# Altium schematic sheet 44-HARDWARE SCHEMATICS.SchDoc
size 513 x 386 mm
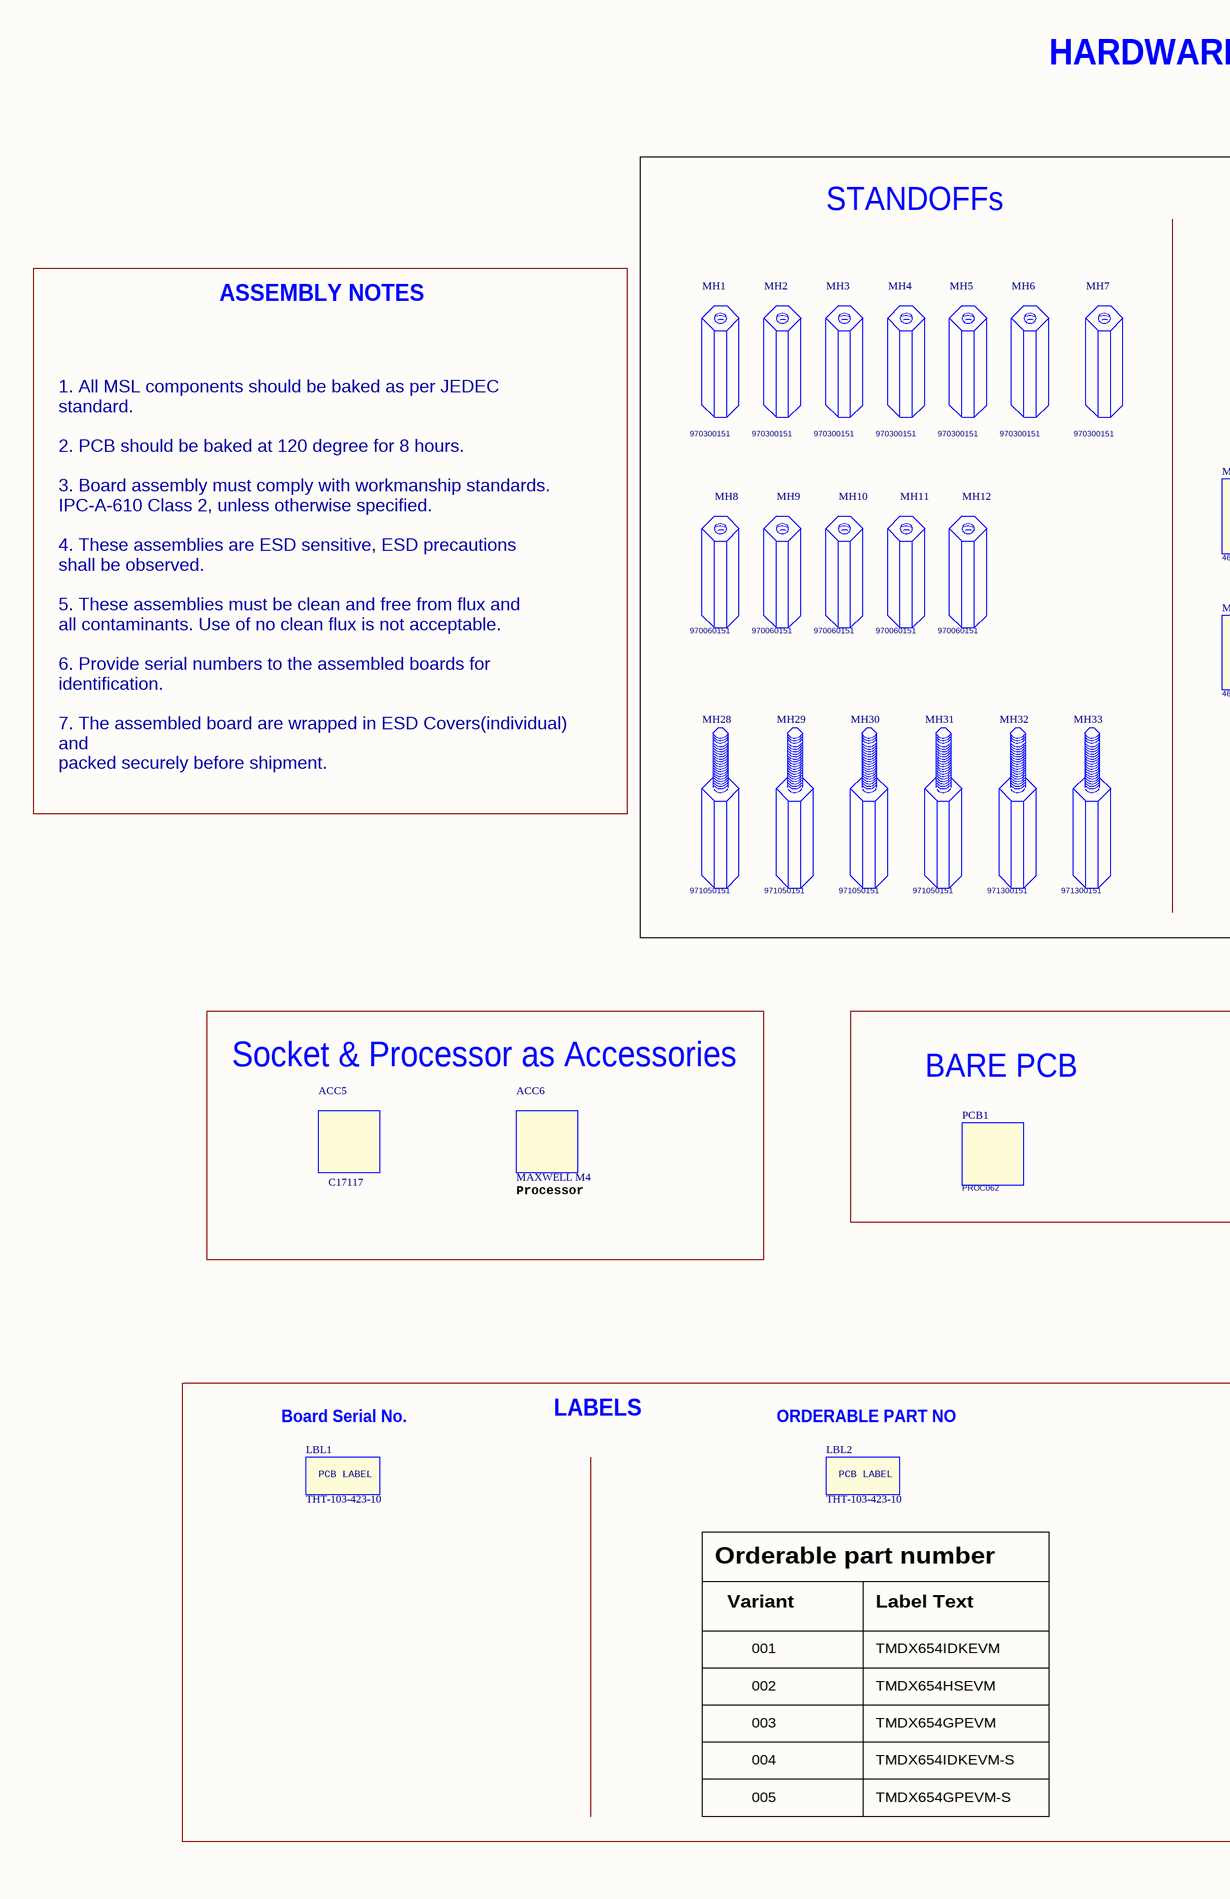
[diagram p0: 44-HARDWARE SCHEMATICS.SchDoc, left]
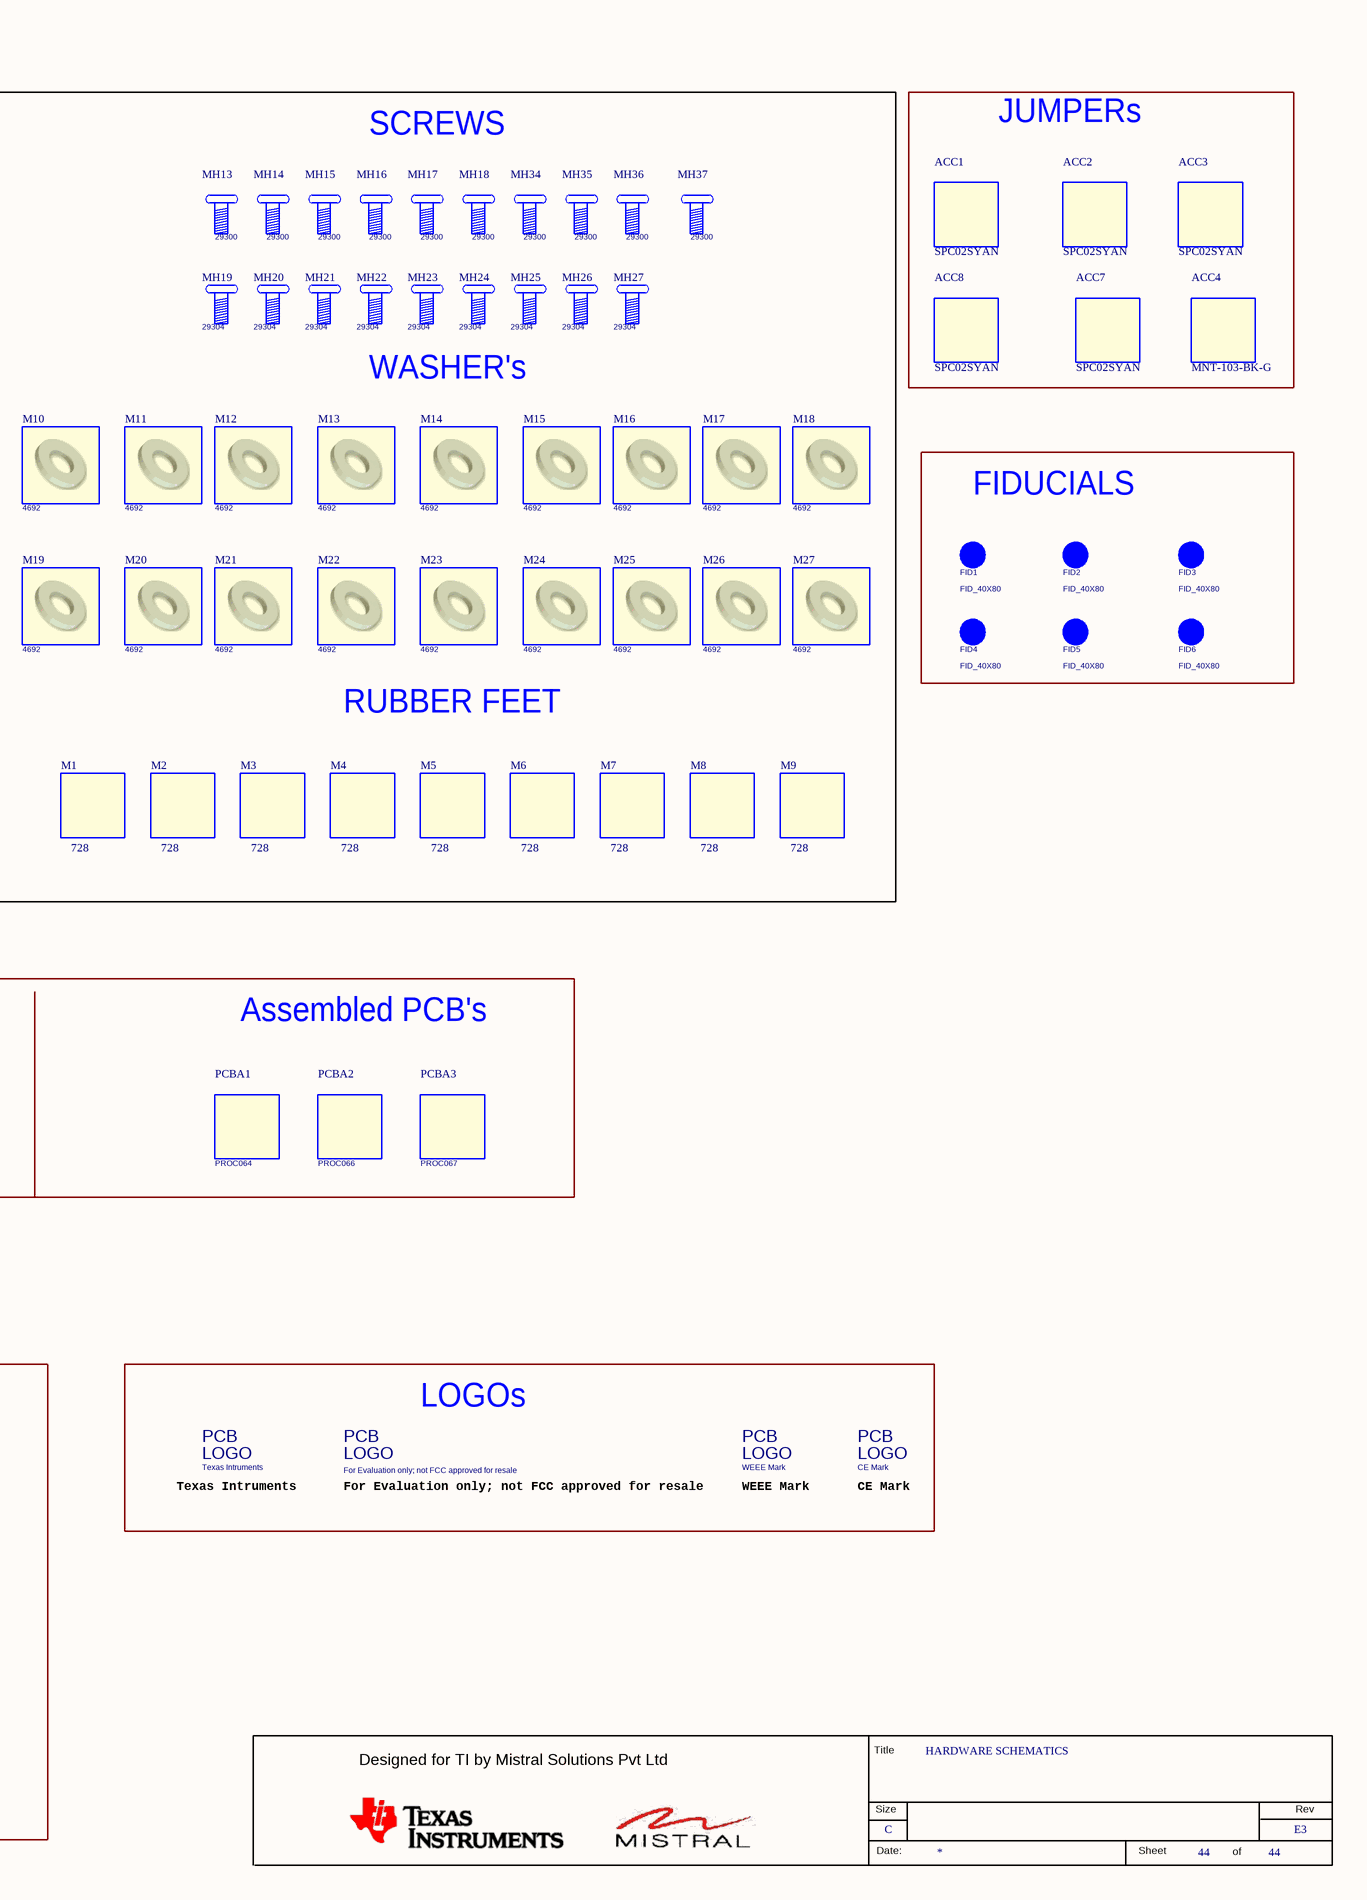
[diagram p1: 44-HARDWARE SCHEMATICS.SchDoc, right]

## Parts
*  RevCode: E3  Title: HARDWARE SCHEMATICS  Page Size: C  Page Number: 44  (hidden comment: MISTRAL_TITLEBLK_CSIZE)  (graphical)
ACC1  SPC02SYAN  [NA]  (mechanical)
ACC2  SPC02SYAN  [NA]  (mechanical)
ACC3  SPC02SYAN  [NA]  (mechanical)
ACC4  MNT-103-BK-G  [NA]  (mechanical)
ACC5  C17117  [BGASKT784_C17117_2170X2170_37-4]
ACC6  MAXWELL M4  [DNI]  (mechanical)
ACC7  SPC02SYAN  [NA]  (mechanical)
ACC8  SPC02SYAN  [NA]  (mechanical)
FID1  FID_40X80  [Fiducial10-20]  (mechanical)
FID2  FID_40X80  [Fiducial10-20]  (mechanical)
FID3  FID_40X80  [Fiducial10-20]  (mechanical)
FID4  FID_40X80  [Fiducial10-20]  (mechanical)
FID5  FID_40X80  [Fiducial10-20]  (mechanical)
FID6  FID_40X80  [Fiducial10-20]  (mechanical)
LBL1  THT-103-423-10  [NA]  (mechanical)
LBL2  THT-103-423-10  [NA]  (mechanical)
Logo1  Texas Intruments  [TI_Stacked_Overlay_Small]  (mechanical)
Logo2  For Evaluation only; not FCC approved for resale  [FCC_disclaimer]  (mechanical)
Logo3  WEEE Mark  [TI_Stacked_Overlay_Small]  (mechanical)
Logo4  CE Mark  [TI_Stacked_Overlay_Small]  (mechanical)
M1  728  [NA]  (mechanical)
M2  728  [NA]  (mechanical)
M3  728  [NA]  (mechanical)
M4  728  [NA]  (mechanical)
M5  728  [NA]  (mechanical)
M6  728  [NA]  (mechanical)
M7  728  [NA]  (mechanical)
M8  728  [NA]  (mechanical)
M9  728  [NA]  (mechanical)
M10  Mfr_part_number: 4692  [NA]  (hidden comment: PLAIN WASHER_M3)  (mechanical)
M11  Mfr_part_number: 4692  [NA]  (hidden comment: PLAIN WASHER_M3)  (mechanical)
M12  Mfr_part_number: 4692  [NA]  (hidden comment: PLAIN WASHER_M3)  (mechanical)
M13  Mfr_part_number: 4692  [NA]  (hidden comment: PLAIN WASHER_M3)  (mechanical)
M14  Mfr_part_number: 4692  [NA]  (hidden comment: PLAIN WASHER_M3)  (mechanical)
M15  Mfr_part_number: 4692  [NA]  (hidden comment: PLAIN WASHER_M3)  (mechanical)
M16  Mfr_part_number: 4692  [NA]  (hidden comment: PLAIN WASHER_M3)  (mechanical)
M17  Mfr_part_number: 4692  [NA]  (hidden comment: PLAIN WASHER_M3)  (mechanical)
M18  Mfr_part_number: 4692  [NA]  (hidden comment: PLAIN WASHER_M3)  (mechanical)
M19  Mfr_part_number: 4692  [NA]  (hidden comment: PLAIN WASHER_M3)  (mechanical)
M20  Mfr_part_number: 4692  [NA]  (hidden comment: PLAIN WASHER_M3)  (mechanical)
M21  Mfr_part_number: 4692  [NA]  (hidden comment: PLAIN WASHER_M3)  (mechanical)
M22  Mfr_part_number: 4692  [NA]  (hidden comment: PLAIN WASHER_M3)  (mechanical)
M23  Mfr_part_number: 4692  [NA]  (hidden comment: PLAIN WASHER_M3)  (mechanical)
M24  Mfr_part_number: 4692  [NA]  (hidden comment: PLAIN WASHER_M3)  (mechanical)
M25  Mfr_part_number: 4692  [NA]  (hidden comment: PLAIN WASHER_M3)  (mechanical)
M26  Mfr_part_number: 4692  [NA]  (hidden comment: PLAIN WASHER_M3)  (mechanical)
M27  Mfr_part_number: 4692  [NA]  (hidden comment: PLAIN WASHER_M3)  (mechanical)
MH1  Mfr_part_number: 970300151  [NA]  (hidden comment: HEX SPACER_M2.5 X 30)  (mechanical)
MH2  Mfr_part_number: 970300151  [NA]  (hidden comment: HEX SPACER_M2.5 X 30)  (mechanical)
MH3  Mfr_part_number: 970300151  [NA]  (hidden comment: HEX SPACER_M2.5 X 30)  (mechanical)
MH4  Mfr_part_number: 970300151  [NA]  (hidden comment: HEX SPACER_M2.5 X 30)  (mechanical)
MH5  Mfr_part_number: 970300151  [NA]  (hidden comment: HEX SPACER_M2.5 X 30)  (mechanical)
MH6  Mfr_part_number: 970300151  [NA]  (hidden comment: HEX SPACER_M2.5 X 30)  (mechanical)
MH7  Mfr_part_number: 970300151  [NA]  (hidden comment: HEX SPACER_M2.5 X 30)  (mechanical)
MH8  Mfr_part_number: 970060151  [NA]  (hidden comment: HEX SPACER_M2.5 X 6)  (mechanical)
MH9  Mfr_part_number: 970060151  [NA]  (hidden comment: HEX SPACER_M2.5 X 6)  (mechanical)
MH10  Mfr_part_number: 970060151  [NA]  (hidden comment: HEX SPACER_M2.5 X 6)  (mechanical)
MH11  Mfr_part_number: 970060151  [NA]  (hidden comment: HEX SPACER_M2.5 X 6)  (mechanical)
MH12  Mfr_part_number: 970060151  [NA]  (hidden comment: HEX SPACER_M2.5 X 6)  (mechanical)
MH13  Mfr_part_number: 29300  [NA]  (hidden comment: PAN HEAD_M2.5 X 4)  (mechanical)
MH14  Mfr_part_number: 29300  [NA]  (hidden comment: PAN HEAD_M2.5 X 4)  (mechanical)
MH15  Mfr_part_number: 29300  [NA]  (hidden comment: PAN HEAD_M2.5 X 4)  (mechanical)
MH16  Mfr_part_number: 29300  [NA]  (hidden comment: PAN HEAD_M2.5 X 4)  (mechanical)
MH17  Mfr_part_number: 29300  [NA]  (hidden comment: PAN HEAD_M2.5 X 4)  (mechanical)
MH18  Mfr_part_number: 29300  [NA]  (hidden comment: PAN HEAD_M2.5 X 4)  (mechanical)
MH19  Mfr_part_number: 29304  [NA]  (hidden comment: PAN HEAD_M2.5 X 12)  (mechanical)
MH20  Mfr_part_number: 29304  [NA]  (hidden comment: PAN HEAD_M2.5 X 12)  (mechanical)
MH21  Mfr_part_number: 29304  [NA]  (hidden comment: PAN HEAD_M2.5 X 12)  (mechanical)
MH22  Mfr_part_number: 29304  [NA]  (hidden comment: PAN HEAD_M2.5 X 12)  (mechanical)
MH23  Mfr_part_number: 29304  [NA]  (hidden comment: PAN HEAD_M2.5 X 12)  (mechanical)
MH24  Mfr_part_number: 29304  [NA]  (hidden comment: PAN HEAD_M2.5 X 12)  (mechanical)
MH25  Mfr_part_number: 29304  [NA]  (hidden comment: PAN HEAD_M2.5 X 12)  (mechanical)
MH26  Mfr_part_number: 29304  [NA]  (hidden comment: PAN HEAD_M2.5 X 12)  (mechanical)
MH27  Mfr_part_number: 29304  [NA]  (hidden comment: PAN HEAD_M2.5 X 12)  (mechanical)
MH28  Mfr_part_number: 971050151  [NA]  (hidden comment: HEX SPACER_M2.5 X 5)  (mechanical)
MH29  Mfr_part_number: 971050151  [NA]  (hidden comment: HEX SPACER_M2.5 X 5)  (mechanical)
MH30  Mfr_part_number: 971050151  [NA]  (hidden comment: HEX SPACER_M2.5 X 5)  (mechanical)
MH31  Mfr_part_number: 971050151  [NA]  (hidden comment: HEX SPACER_M2.5 X 5)  (mechanical)
MH32  Mfr_part_number: 971300151  [NA]  (hidden comment: HEX SPACER_M2.5 X 30)  (mechanical)
MH33  Mfr_part_number: 971300151  [NA]  (hidden comment: HEX SPACER_M2.5 X 30)  (mechanical)
MH34  Mfr_part_number: 29300  [NA]  (hidden comment: PAN HEAD_M2.5 X 4)  (mechanical)
MH35  Mfr_part_number: 29300  [NA]  (hidden comment: PAN HEAD_M2.5 X 4)  (mechanical)
MH36  Mfr_part_number: 29300  [NA]  (hidden comment: PAN HEAD_M2.5 X 4)  (mechanical)
MH37  Mfr_part_number: 29300  [NA]  (hidden comment: PAN HEAD_M2.5 X 4)  (mechanical)
PCB1  Mfr_part_number: PROC062  [NA]  (hidden comment: AM65x EVM BARE PCB)  (mechanical)
PCBA1  Mfr_part_number: PROC064  [NA]  (hidden comment: AM6x IDK APPLICATION CARD)  (mechanical)
PCBA2  Mfr_part_number: PROC066  [NA]  (hidden comment: AM6x USB3/PCIE SERDES CARD)  (mechanical)
PCBA3  Mfr_part_number: PROC067  [NA]  (hidden comment: AM6x PCIE-2 LANE SERDES CARD)  (mechanical)

## Blocks framed on the sheet
JUMPERs: ACC1-ACC4 ACC7 ACC8
FIDUCIALS: FID1-FID6
Socket & Processor as Accessories: ACC5 ACC6
LABELS: LBL1 LBL2
LOGOs: Logo1-Logo4

## Notes on the sheet
- HARDWARE SCHEMATICS
- STANDOFFs
- SCREWS
- ASSEMBLY NOTES
- WASHER's
- RUBBER FEET
- 1. All MSL components should be baked as per JEDEC
  standard.
  2. PCB should be baked at 120 degree for 8 hours.
  3. Board assembly must comply with workmanship standards.
  IPC-A-610 Class 2, unless otherwise specified.
  4. These assemblies are ESD sensitive, ESD precautions
  shall be observed.
  5. These assemblies must be clean and free from flux and
  all contaminants. Use of no clean flux is not acceptable.
  6. Provide serial numbers to the assembled boards for
  identification.
  7. The assembled board are wrapped in ESD Covers(individual)
  and
  packed securely before shipment.
- (near PCB1) BARE PCB
- Assembled PCB's
- Processor
- (near LBL1) Board Serial No.
- (near LBL2) ORDERABLE PART NO
- Texas Intruments
- For Evaluation only; not FCC approved for resale
- WEEE Mark
- CE Mark
- Orderable part number
- Variant
- 001
- Label Text
- TMDX654IDKEVM
- 002
- TMDX654HSEVM
- 003
- 004
- TMDX654GPEVM
- TMDX654IDKEVM-S
- 005
- TMDX654GPEVM-S
- (in symbol ACCESSORY_THT-3-423-10) PCB LABEL
- (in symbol FCC_disclaimer) PCB; LOGO
- (in symbol MISTRAL_TITLEBLK_CSIZE) Title; Designed for TI by Mistral Solutions Pvt Ltd; Size; Rev; Date:; Sheet; of
- (in symbol TI_Logo) PCB; LOGO
- (in symbol TI_Logo_Dup1) PCB; LOGO

## Library data of the parts
* = MISTRAL_TITLEBLK_CSIZE: Issue: 1.0; Page Create Date: March  8, 1995; Page Count: 44; Page Modify Date: *
ACC1 ACC3 ACC7 = ACCESSORY: ACCESSORIE JUMPER SHORTING GOLD FLASH; Mistral Part No: 160009030153-R; Mfr_name: SULLINS CONNECTOR; Part_type: ACCESSORIES; Project: SMART VIEW_NVR; PCB Footprint: NA; Footprint Path: Y:\MIS_DATABASE\Library\ALTIUM_TOOL\PCB_FOOTPRINTS\Altium_Footprint_Lib.PcbLib; Library Path: Y:\MIS_DATABASE\Library\ALTIUM_TOOL\SCHEMATICS_PARTS\MS_MECHANICAL_Library.schlib; MECHANICAL 3D STEP FILE: NA; Temperature: -55°C+105°C; Weight: NA; Wattage: NA; Voltage: NA; Tolerance: NA; Mfr_part_number: SPC02SYAN; Package: NA; Distributor_name: DIGIKEY; Distributor_part_number: S9001-ND; Library Ref: ACCESSORY; Height: NA; Datasheet: Y:\MIS_DATABASE\DATASHEETS\MISC\MODULES\SPC02SYAN.PDF; Crtd /date: USMAN/301208; Chkd/date: SUHAS\211010
ACC2 ACC8 = ACCESSORY: ACCESSORIE JUMPER SHORTING GOLD FLASH; Part_type: ACCESSORIES; Mfr_name: SULLINS CONNECTOR; Mistral Part No: 160009030153-R; Project: SMART VIEW_NVR; PCB Footprint: NA; Footprint Path: Y:\MIS_DATABASE\Library\ALTIUM_TOOL\PCB_FOOTPRINTS\Altium_Footprint_Lib.PcbLib; Library Path: Y:\MIS_DATABASE\Library\ALTIUM_TOOL\SCHEMATICS_PARTS\MS_MECHANICAL_Library.schlib; MECHANICAL 3D STEP FILE: NA; Temperature: -55°C+105°C; Weight: NA; Wattage: NA; Voltage: NA; Tolerance: NA; Chkd/date: SUHAS\211010; Crtd /date: USMAN/301208; Datasheet: Y:\MIS_DATABASE\DATASHEETS\MISC\MODULES\SPC02SYAN.PDF; Height: NA; Library Ref: ACCESSORY; Distributor_part_number: S9001-ND; Distributor_name: DIGIKEY; Package: NA; Mfr_part_number: SPC02SYAN
ACC4 = ACCESSORY: ACCESSORIE CONNECTOR SHUNT 2X3 POS EDGE MOUNT SOCKET STRIP; Part_type: ACCESSORIES; Mfr_name: SAMTEC; Mistral Part No: 160017110050-R; Project: TI_MAXIE_CPB; PCB Footprint: NA; MECHANICAL 3D STEP FILE: NA; Chkd/date: MANIRAJA/141117; Crtd /date: MANIRAJA/141117; Datasheet: Y:\MIS_DATABASE\DATASHEETS\MISC\ACCESSORIES\SAMTEC-MNT-SER.PDF; Temperature: -55°C+125°C; Weight: NA; Height: NA; Distributor_part_number: SAM10620-ND; Distributor_name: DIGIKEY; Package: NA; Wattage: NA; Voltage: NA; Tolerance: NA; Mfr_part_number: MNT-103-BK-G; Library Ref: ACCESSORY
ACC5 = ACCESSORY: ACCESSORIE BGA SOCKET MAXWELL M4 MICROPROCESSOR BGA784; Part_type: ACCESSORIES; Mfr_name: IRONWOOD ELECTRONICS; Mistral Part No: 160017090045; Wattage: NA; Project: TI_SVB_MAXWELL_DUT; MECHANICAL 3D STEP FILE: BGASKT784_C17117_2170X2170_37-4; Chkd/date: MANIRAJA/190917; Crtd /date: MANIRAJA/190917; Datasheet: Y:\MIS_DATABASE\DATASHEETS\MISC\ACCESSORIES\C17117.PDF; Temperature: NA; Weight: 105.46g; Height: 37.34MM; Library Ref: ACCESSORY; Distributor_part_number: NA; Distributor_name: NA; Package: BGA784; Voltage: NA; Tolerance: NA; Mfr_part_number: C17117; PCB Footprint: BGASKT784_C17117_2170X2170_37-4
ACC6 = ACCESSORY: IC MAXWELL MICRO CONTROLLER UNIT BGA784; Part_type: ICS\DIGITAL\MICROCONTROLLER; Mfr_name: TEXAS INSTRUMENTS; Mistral Part No: 141217070003; MECHANICAL 3D STEP FILE: BGA784_31-49_910X910_1-7; Wattage: NA; Project: TI_SVB_MAXWELL_DUT; Customs_HS_Code: 85423100; Custom_Duty: 15%; Chkd/date: MANIRAJA/130717; Crtd /date: MANIRAJA/130717; Datasheet: Y:\MIS_DATABASE\DATASHEETS\ICS\DIGITAL\MICROCONTROLLER\MAXWELLM4.PDF; Temperature: NA; Weight: NA; Height: 1.63MM; Distributor_part_number: NA; Distributor_name: NA; Package: BGA784; Voltage: NA; Tolerance: NA; Mfr_part_number: MAXWELL M4; Library Ref: MAXWELLM4; PCB Footprint: BGA784_31-49_910X910_1-7
FID1-FID6 = Fiducial: NI_MARK: DNI; PCB Footprint: FID_40X80
LBL1 LBL2 = ACCESSORY_THT-3-423-10: ACCESSORIE 1 WORKHORSE POLYSTER LABLE 0.25" X 1"; Mistral Part No: 160018020185; Mfr_name: BRADY; Part_type: ACCESSORIES; Project: TI_MAXIE_CPB; Mfr_part_number: THT-103-423-10; Tolerance: NA; Voltage: NA; Wattage: NA; Package: NA; Distributor_name: NA; Distributor_part_number: NA; Library Ref: ACCESSORY_THT-3-423-10; Footprint Ref: NA; Height: NA; Weight: NA; Temperature: NA; Datasheet: NA; Crtd /date: ALVY/260218; Chkd/date: MANIRAJA/270218; MECHANICAL 3D STEP FILE: NA; Library Path: Y:\MIS_DATABASE\Library\ALTIUM_TOOL\SCHEMATICS_PARTS\MS_MECHANICAL_Library.schlib; Footprint Path: Y:\MIS_DATABASE\Library\ALTIUM_TOOL\PCB_FOOTPRINTS\Altium_Footprint_Lib.PcbLib; PCB Footprint: NA
Logo1 Logo3 = TI_Logo_Dup1: NI_MARK: DNI
Logo2 = FCC_disclaimer: NI_MARK: DNI; PCB Footprint: FCC_disclaimer
Logo4 = TI_Logo: NI_MARK: DNI; PCB Footprint: TI_Stacked_Overlay_Small
M1 M4 M7 = ACCESSORY: ACCESSORIE RECESSED BUMPER 19.05MM DIA; Part_type: ACCESSORIES; Mfr_name: KEYSTONE; Mistral Part No: 160018070042-R; Project: TI_MAXIE_CPB; Footprint Path: NA; Library Path: NA; MECHANICAL 3D STEP FILE: NA; Custom_Duty: NA; Customs_HS_Code: NA; Chkd/date: MANIRAJA/110718; Crtd /date: MANIRAJA/110718; Datasheet: Y:\MIS_DATABASE\DATASHEETS\MISC\ACCESSORIES\728.PDF; Temperature: NA; Weight: 2042mg; Height: NA; Library Ref: ACCESSORY; Distributor_part_number: 36-728-ND; Distributor_name: DIGIKEY; Package: NA; Wattage: NA; Voltage: NA; Tolerance: NA; Mfr_part_number: 728; Footprint Ref: NA; PCB Footprint: NA
M2 M3 M5 M6 M8 M9 = ACCESSORY: ACCESSORIE RECESSED BUMPER 19.05MM DIA; Mistral Part No: 160018070042-R; Mfr_name: KEYSTONE; Part_type: ACCESSORIES; Project: TI_MAXIE_CPB; Footprint Ref: NA; Mfr_part_number: 728; Tolerance: NA; Voltage: NA; Wattage: NA; Package: NA; Distributor_name: DIGIKEY; Distributor_part_number: 36-728-ND; Library Ref: ACCESSORY; Height: NA; Weight: 2042mg; Temperature: NA; Datasheet: Y:\MIS_DATABASE\DATASHEETS\MISC\ACCESSORIES\728.PDF; Crtd /date: MANIRAJA/110718; Chkd/date: MANIRAJA/110718; Customs_HS_Code: NA; Custom_Duty: NA; MECHANICAL 3D STEP FILE: NA; Library Path: NA; Footprint Path: NA; PCB Footprint: NA
M10-M12 M14 M16 M18-M24 M26 M27 = WASHER_PLAIN: PLAIN WASHER FOR M3 SS-316; Part_type: MECHANICAL\WASHERS; Mfr_name: KEYSTONE; Mistral Part No: 160018020078-R; Project: TI_MAXIE_CPB; Footprint Path: Y:\MIS_DATABASE\Library\ALTIUM_TOOL\PCB_FOOTPRINTS\Altium_Footprint_Lib.PcbLib; Library Path: Y:\MIS_DATABASE\Library\ALTIUM_TOOL\SCHEMATICS_PARTS\MS_MECHANICAL_Library.schlib; MECHANICAL 3D STEP FILE: NA; Chkd/date: MANIRAJA/190218; Crtd /date: MANIRAJA/190218; Datasheet: Y:\MIS_DATABASE\DATASHEETS\MISC\MECHANICAL\4692.PDF; Temperature: NA; Weight: NA; Height: NA; Footprint Ref: NA; Library Ref: WASHER_PLAIN; Distributor_part_number: 36-4692-ND; Distributor_name: DIGIKEY; Package: SS; Wattage: NA; Voltage: NA; Tolerance: NA; PCB Footprint: NA
M13 M15 M17 M25 = WASHER_PLAIN: PLAIN WASHER FOR M3 SS-316; Mistral Part No: 160018020078-R; Mfr_name: KEYSTONE; Part_type: MECHANICAL\WASHERS; Project: TI_MAXIE_CPB; Tolerance: NA; Voltage: NA; Wattage: NA; Package: SS; Distributor_name: DIGIKEY; Distributor_part_number: 36-4692-ND; Library Ref: WASHER_PLAIN; Footprint Ref: NA; Height: NA; Weight: NA; Temperature: NA; Datasheet: Y:\MIS_DATABASE\DATASHEETS\MISC\MECHANICAL\4692.PDF; Crtd /date: MANIRAJA/190218; Chkd/date: MANIRAJA/190218; MECHANICAL 3D STEP FILE: NA; Library Path: Y:\MIS_DATABASE\Library\ALTIUM_TOOL\SCHEMATICS_PARTS\MS_MECHANICAL_Library.schlib; Footprint Path: Y:\MIS_DATABASE\Library\ALTIUM_TOOL\PCB_FOOTPRINTS\Altium_Footprint_Lib.PcbLib; PCB Footprint: NA
MH1 = HEX_SPACER_FF: HEX SPACER FEMALE TO FEMALE M2.5 X 30MM; Part_type: MECHANICAL\SPACER; Mfr_name: WURTH ELECTRONICS; Mistral Part No: 160018020071-R; Project: TI_MAXIE_CPB; Footprint Path: Y:\MIS_DATABASE\Library\ALTIUM_TOOL\PCB_FOOTPRINTS\Altium_Footprint_Lib.PcbLib; Library Path: Y:\MIS_DATABASE\Library\ALTIUM_TOOL\SCHEMATICS_PARTS\MS_MECHANICAL_Library.schlib; MECHANICAL 3D STEP FILE: NA; Chkd/date: MANIRAJA/190218; Crtd /date: MANIRAJA/190218; Datasheet: Y:\MIS_DATABASE\DATASHEETS\MISC\MECHANICAL\970XXX1.PDF; Temperature: NA; Weight: NA; Height: 30.00MM; Footprint Ref: NA; Library Ref: HEX_SPACER_FF; Distributor_part_number: 732-10626-ND; Distributor_name: DIGIKEY; Package: SS; Wattage: NA; Voltage: NA; Tolerance: NA; PCB Footprint: NA
MH2-MH7 = HEX_SPACER_FF: HEX SPACER FEMALE TO FEMALE M2.5 X 30MM; Mistral Part No: 160018020071-R; Mfr_name: WURTH ELECTRONICS; Part_type: MECHANICAL\SPACER; Project: TI_MAXIE_CPB; Tolerance: NA; Voltage: NA; Wattage: NA; Package: SS; Distributor_name: DIGIKEY; Distributor_part_number: 732-10626-ND; Library Ref: HEX_SPACER_FF; Footprint Ref: NA; Height: 30.00MM; Weight: NA; Temperature: NA; Datasheet: Y:\MIS_DATABASE\DATASHEETS\MISC\MECHANICAL\970XXX1.PDF; Crtd /date: MANIRAJA/190218; Chkd/date: MANIRAJA/190218; MECHANICAL 3D STEP FILE: NA; Library Path: Y:\MIS_DATABASE\Library\ALTIUM_TOOL\SCHEMATICS_PARTS\MS_MECHANICAL_Library.schlib; Footprint Path: Y:\MIS_DATABASE\Library\ALTIUM_TOOL\PCB_FOOTPRINTS\Altium_Footprint_Lib.PcbLib; PCB Footprint: NA
MH8-MH12 = HEX_SPACER_FF: HEX SPACER FEMALE TO FEMALE M2.5 X 6MM; Mistral Part No: 160018020075-R; Mfr_name: WURTH ELECTRONICS; Part_type: MECHANICAL\SPACER; Project: TI_MAXIE_CPB; Tolerance: NA; Voltage: NA; Wattage: NA; Package: SS; Distributor_name: DIGIKEY; Distributor_part_number: 732-10524-ND; Library Ref: HEX_SPACER_FF; Footprint Ref: NA; Height: 6.00MM; Weight: NA; Temperature: NA; Datasheet: Y:\MIS_DATABASE\DATASHEETS\MISC\MECHANICAL\970XXX1.PDF; Crtd /date: MANIRAJA/190218; Chkd/date: MANIRAJA/190218; MECHANICAL 3D STEP FILE: NA; Library Path: Y:\MIS_DATABASE\Library\ALTIUM_TOOL\SCHEMATICS_PARTS\MS_MECHANICAL_Library.schlib; Footprint Path: Y:\MIS_DATABASE\Library\ALTIUM_TOOL\PCB_FOOTPRINTS\Altium_Footprint_Lib.PcbLib; PCB Footprint: NA
MH13 MH14 MH18 MH35 = SCREW_PAN: PHILLIPS PAN HEAD SCREW - M2.5 X 4 SS-316; Part_type: MECHANICAL\SCREWS; Mfr_name: KEYSTONE; Mistral Part No: 160018020076-R; Project: TI_MAXIE_CPB; Footprint Path: Y:\MIS_DATABASE\Library\ALTIUM_TOOL\PCB_FOOTPRINTS\Altium_Footprint_Lib.PcbLib; Library Path: Y:\MIS_DATABASE\Library\ALTIUM_TOOL\SCHEMATICS_PARTS\MS_MECHANICAL_Library.schlib; MECHANICAL 3D STEP FILE: NA; Chkd/date: MANIRAJA/190218; Crtd /date: MANIRAJA/190218; Datasheet: Y:\MIS_DATABASE\DATASHEETS\MISC\MECHANICAL\29300.PDF; Temperature: NA; Weight: NA; Height: 4.00MM; Footprint Ref: NA; Library Ref: SCREW_PAN; Distributor_part_number: 36-29300-ND; Distributor_name: DIGIKEY; Package: SS; Wattage: NA; Voltage: NA; Tolerance: NA; PCB Footprint: NA
MH15-MH17 MH34 MH36 MH37 = SCREW_PAN: PHILLIPS PAN HEAD SCREW - M2.5 X 4 SS-316; Mistral Part No: 160018020076-R; Mfr_name: KEYSTONE; Part_type: MECHANICAL\SCREWS; Project: TI_MAXIE_CPB; Tolerance: NA; Voltage: NA; Wattage: NA; Package: SS; Distributor_name: DIGIKEY; Distributor_part_number: 36-29300-ND; Library Ref: SCREW_PAN; Footprint Ref: NA; Height: 4.00MM; Weight: NA; Temperature: NA; Datasheet: Y:\MIS_DATABASE\DATASHEETS\MISC\MECHANICAL\29300.PDF; Crtd /date: MANIRAJA/190218; Chkd/date: MANIRAJA/190218; MECHANICAL 3D STEP FILE: NA; Library Path: Y:\MIS_DATABASE\Library\ALTIUM_TOOL\SCHEMATICS_PARTS\MS_MECHANICAL_Library.schlib; Footprint Path: Y:\MIS_DATABASE\Library\ALTIUM_TOOL\PCB_FOOTPRINTS\Altium_Footprint_Lib.PcbLib; PCB Footprint: NA
MH19 MH21 MH23 MH25 = SCREW_PAN: PHILLIPS PAN HEAD SCREW - M2.5 X 12; Part_type: ACCESSORIES; Mfr_name: KEYSTONE; Mistral Part No: 160018070043-R; Project: TI_MAXIE_CPB; Footprint Path: NA; Library Path: NA; MECHANICAL 3D STEP FILE: NA; Custom_Duty: NA; Customs_HS_Code: NA; Chkd/date: MANIRAJA/110718; Crtd /date: MANIRAJA/110718; Datasheet: Y:\MIS_DATABASE\DATASHEETS\MISC\MECHANICAL\29304.PDF; Temperature: NA; Weight: NA; Height: 12.00MM; Library Ref: SCREW_PAN; Distributor_part_number: 36-29304-ND; Distributor_name: DIGIKEY; Package: NA; Wattage: NA; Voltage: NA; Tolerance: NA; Footprint Ref: NA; PCB Footprint: NA
MH20 MH22 MH24 MH26 MH27 = SCREW_PAN: PHILLIPS PAN HEAD SCREW - M2.5 X 12; Mistral Part No: 160018070043-R; Mfr_name: KEYSTONE; Part_type: ACCESSORIES; Project: TI_MAXIE_CPB; Footprint Ref: NA; Tolerance: NA; Voltage: NA; Wattage: NA; Package: NA; Distributor_name: DIGIKEY; Distributor_part_number: 36-29304-ND; Library Ref: SCREW_PAN; Height: 12.00MM; Weight: NA; Temperature: NA; Datasheet: Y:\MIS_DATABASE\DATASHEETS\MISC\MECHANICAL\29304.PDF; Crtd /date: MANIRAJA/110718; Chkd/date: MANIRAJA/110718; Customs_HS_Code: NA; Custom_Duty: NA; MECHANICAL 3D STEP FILE: NA; Library Path: NA; Footprint Path: NA; PCB Footprint: NA
MH28 = HEX_SPACER_MF: HEX SPACER MALE TO FEMALE M2.5 X 5MM; Mistral Part No: 160018020072-R; Mfr_name: WURTH ELECTRONICS; Part_type: MECHANICAL\SPACER; Project: TI_MAXIE_CPB; Tolerance: NA; Voltage: NA; Wattage: NA; Package: SS; Distributor_name: DIGIKEY; Distributor_part_number: 732-10380-ND; Library Ref: HEX_SPACER_MF; Footprint Ref: NA; Height: 5.00MM; Weight: NA; Temperature: NA; Datasheet: Y:\MIS_DATABASE\DATASHEETS\MISC\MECHANICAL\971XX0XX1.PDF; Crtd /date: MANIRAJA/190218; Chkd/date: MANIRAJA/190218; MECHANICAL 3D STEP FILE: NA; Library Path: Y:\MIS_DATABASE\Library\ALTIUM_TOOL\SCHEMATICS_PARTS\MS_MECHANICAL_Library.schlib; Footprint Path: Y:\MIS_DATABASE\Library\ALTIUM_TOOL\PCB_FOOTPRINTS\Altium_Footprint_Lib.PcbLib; PCB Footprint: NA
MH29-MH31 = HEX_SPACER_MF: HEX SPACER MALE TO FEMALE M2.5 X 5MM; Part_type: MECHANICAL\SPACER; Mfr_name: WURTH ELECTRONICS; Mistral Part No: 160018020072-R; Project: TI_MAXIE_CPB; Footprint Path: Y:\MIS_DATABASE\Library\ALTIUM_TOOL\PCB_FOOTPRINTS\Altium_Footprint_Lib.PcbLib; Library Path: Y:\MIS_DATABASE\Library\ALTIUM_TOOL\SCHEMATICS_PARTS\MS_MECHANICAL_Library.schlib; MECHANICAL 3D STEP FILE: NA; Chkd/date: MANIRAJA/190218; Crtd /date: MANIRAJA/190218; Datasheet: Y:\MIS_DATABASE\DATASHEETS\MISC\MECHANICAL\971XX0XX1.PDF; Temperature: NA; Weight: NA; Height: 5.00MM; Footprint Ref: NA; Library Ref: HEX_SPACER_MF; Distributor_part_number: 732-10380-ND; Distributor_name: DIGIKEY; Package: SS; Wattage: NA; Voltage: NA; Tolerance: NA; PCB Footprint: NA
MH32 MH33 = HEX_SPACER_MF: HEX SPACER MALE TO FEMALE M2.5 X 30MM; Mistral Part No: 160018020073-R; Mfr_name: WURTH ELECTRONICS; Part_type: MECHANICAL\SPACER; Project: TI_MAXIE_CPB; Tolerance: NA; Voltage: NA; Wattage: NA; Package: SS; Distributor_name: DIGIKEY; Distributor_part_number: 732-10464-ND; Library Ref: HEX_SPACER_MF; Footprint Ref: NA; Height: 30.00MM; Weight: NA; Temperature: NA; Datasheet: Y:\MIS_DATABASE\DATASHEETS\MISC\MECHANICAL\971XX0XX1.PDF; Crtd /date: MANIRAJA/190218; Chkd/date: MANIRAJA/190218; MECHANICAL 3D STEP FILE: NA; Library Path: Y:\MIS_DATABASE\Library\ALTIUM_TOOL\SCHEMATICS_PARTS\MS_MECHANICAL_Library.schlib; Footprint Path: Y:\MIS_DATABASE\Library\ALTIUM_TOOL\PCB_FOOTPRINTS\Altium_Footprint_Lib.PcbLib; PCB Footprint: NA
PCB1 = ACCESSORY_PROC062: ACCESSORIE AM65x EVM BARE PCB; Mistral Part No: FY180646000103; Mfr_name: TEXAS INSTRUMENTS; Part_type: ACCESSORIES; Project: TI_MAXIE_CPB; Footprint Ref: NA; Tolerance: NA; Voltage: NA; Wattage: NA; Package: NA; Distributor_name: NA; Distributor_part_number: NA; Library Ref: ACCESSORY_PROC062; Height: NA; Weight: NA; Temperature: NA; Datasheet: NA; Crtd /date: MANIRAJA/230718; Chkd/date: MANIRAJA/230718; RoHS: NA; Customs_HS_Code: NA; Custom_Duty: NA; MECHANICAL 3D STEP FILE: NA; Library Path: NA; Footprint Path: NA; PCB Footprint: NA
PCBA1 = ACCESSORY_PROC064: ACCESSORIE AM6x IDK APPLICATION CARD; Part_type: ACCESSORIES; Mfr_name: TEXAS INSTRUMENTS; Mistral Part No: FY180646000203; Project: TI_MAXIE_CPB; Footprint Path: NA; Library Path: NA; MECHANICAL 3D STEP FILE: NA; Custom_Duty: NA; Customs_HS_Code: NA; RoHS: NA; Chkd/date: MANIRAJA/230718; Crtd /date: MANIRAJA/230718; Datasheet: NA; Temperature: NA; Weight: NA; Height: NA; Library Ref: ACCESSORY_PROC064; Distributor_part_number: NA; Distributor_name: NA; Package: NA; Wattage: NA; Voltage: NA; Tolerance: NA; Footprint Ref: NA; PCB Footprint: NA
PCBA2 = ACCESSORY_PROC064: ACCESSORIE AM6x USB3/PCIE SERDES CARD; Mistral Part No: FY180646000603; Mfr_name: TEXAS INSTRUMENTS; Part_type: ACCESSORIES; Project: TI_MAXIE_CPB; Footprint Ref: NA; Tolerance: NA; Voltage: NA; Wattage: NA; Package: NA; Distributor_name: NA; Distributor_part_number: NA; Library Ref: ACCESSORY_PROC064; Height: NA; Weight: NA; Temperature: NA; Datasheet: NA; Crtd /date: MANIRAJA/230718; Chkd/date: MANIRAJA/230718; RoHS: NA; Customs_HS_Code: NA; Custom_Duty: NA; MECHANICAL 3D STEP FILE: NA; Library Path: NA; Footprint Path: NA; PCB Footprint: NA
PCBA3 = ACCESSORY_PROC064: ACCESSORIE AM6x PCIE-2 LANE SERDES CARD; Part_type: ACCESSORIES; Mfr_name: TEXAS INSTRUMENTS; Mistral Part No: FY180646000803; Project: TI_MAXIE_CPB; Footprint Path: NA; Library Path: NA; MECHANICAL 3D STEP FILE: NA; Custom_Duty: NA; Customs_HS_Code: NA; RoHS: NA; Chkd/date: MANIRAJA/230718; Crtd /date: MANIRAJA/230718; Datasheet: NA; Temperature: NA; Weight: NA; Height: NA; Library Ref: ACCESSORY_PROC064; Distributor_part_number: NA; Distributor_name: NA; Package: NA; Wattage: NA; Voltage: NA; Tolerance: NA; Footprint Ref: NA; PCB Footprint: NA